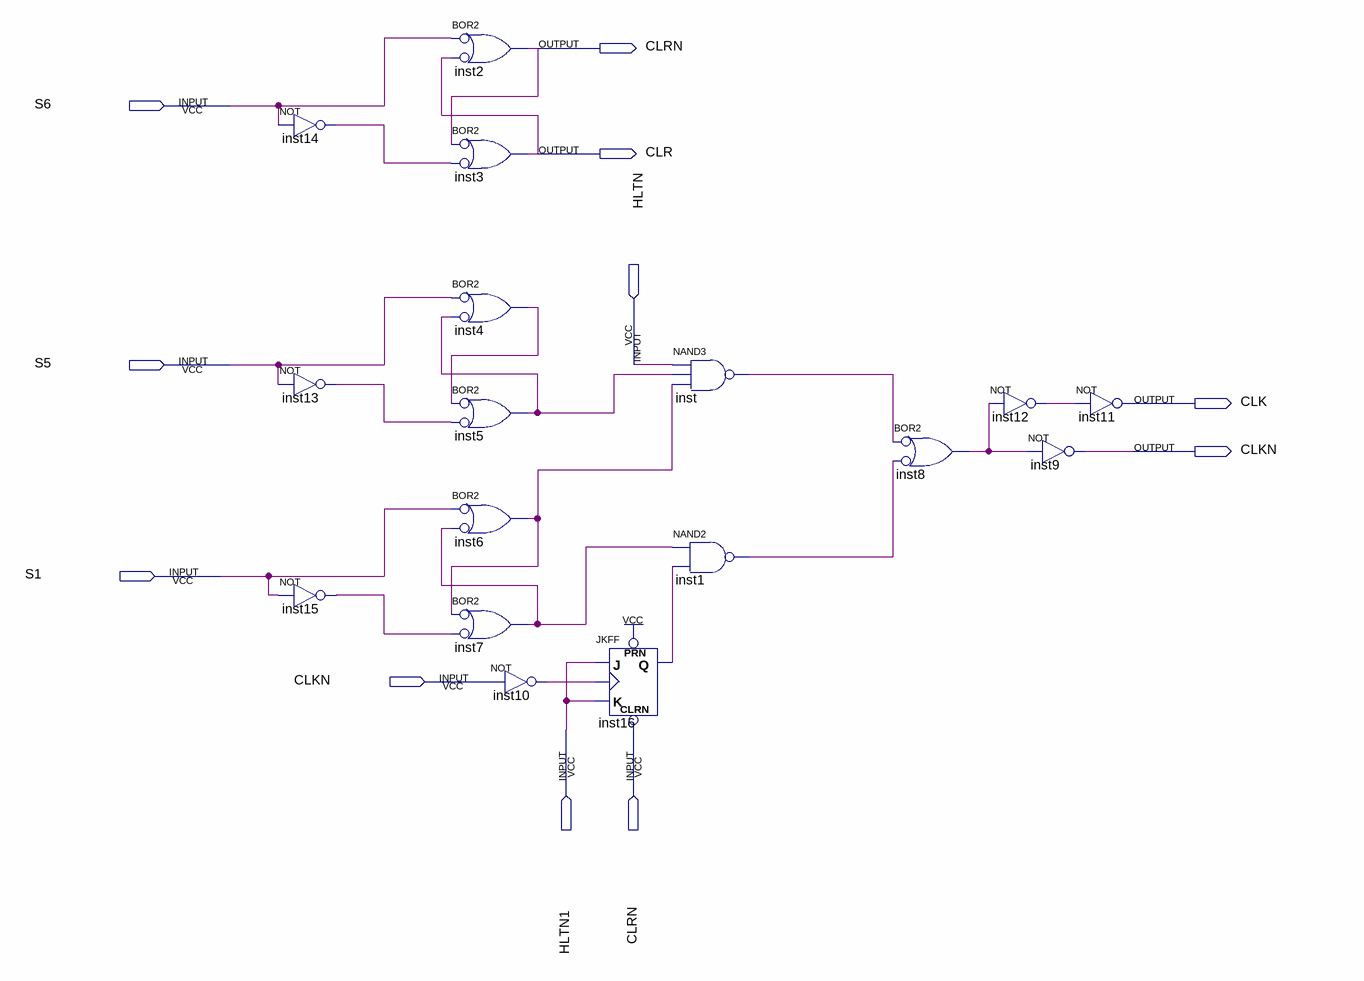
[diagram p0: schematic sheet]
// Quartus schematic Gerador_Clock_eSinal_deReset.bdf as structural Verilog: 17 symbols, 11 pins
module Gerador_Clock_eSinal_deReset (
  input  S6,
  input  S5,
  input  HLTN,
  input  S1,
  inout  CLKN,
  input  HLTN1,
  inout  CLRN,
  output CLR,
  output CLK
);

  wire inst1_out, inst4_out, inst5_out, inst6_out, inst7_out, inst8_out, inst10_out, inst12_out, inst13_out,
       inst14_out, inst15_out, inst16_q, inst_out;

  not inst14 (inst14_out, S6);
  not inst13 (inst13_out, S5);
  not inst15 (inst15_out, S1);
  or inst2 (CLRN, ~S6, ~CLR);  // BOR2
  or inst3 (CLR, ~CLRN, ~inst14_out);  // BOR2
  or inst4 (inst4_out, ~S5, ~inst5_out);  // BOR2
  or inst5 (inst5_out, ~inst4_out, ~inst13_out);  // BOR2
  or inst6 (inst6_out, ~S1, ~inst7_out);  // BOR2
  or inst7 (inst7_out, ~inst6_out, ~inst15_out);  // BOR2
  not inst10 (inst10_out, CLKN);
  JKFF inst16 (.PRN(1'b1), .CLRN(CLRN), .K(HLTN1), .J(HLTN1), .CLK(inst10_out), .Q(inst16_q));
  nand inst (inst_out, HLTN, inst5_out, inst6_out);
  nand inst1 (inst1_out, inst7_out, inst16_q);
  or inst8 (inst8_out, ~inst_out, ~inst1_out);  // BOR2
  not inst12 (inst12_out, inst8_out);
  not inst11 (CLK, inst12_out);
  not inst9 (CLKN, inst8_out);
endmodule
